# EAGLE design match2 (EAGLE 7.2.0)
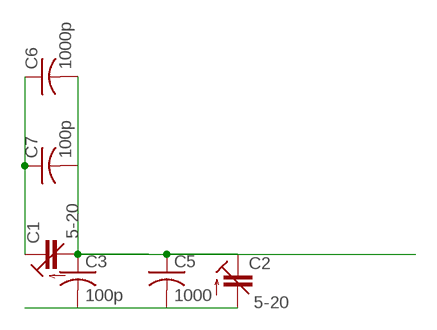
[diagram p0: schematic, sheet 1]

## Parts
C1  5-20  C-TRIMM  [SGC3S]
C2  5-20  C-TRIMM  [SGC3S]
C3  100p  C-USC0603  [C0603]
C5  1000  C-USC0805  [C0805]
C6  1000p  C-USC0805  [C0805]
C7  100p  C-USC0603  [C0603]

## Nets
N$1: C1.P$1(A) C2.P$2(E) C3.1 C5.1 C6.2 C7.2
N$2: C2.P$1(A) C3.2 C5.2
N$7: C1.P$2(E) C6.1 C7.1

## Library data of the parts
C1 C2 = sprague:C-TRIMM: Trimm capacitor
C3 C5-C7 = rcl:C-US: CAPACITOR, American symbol

## Board
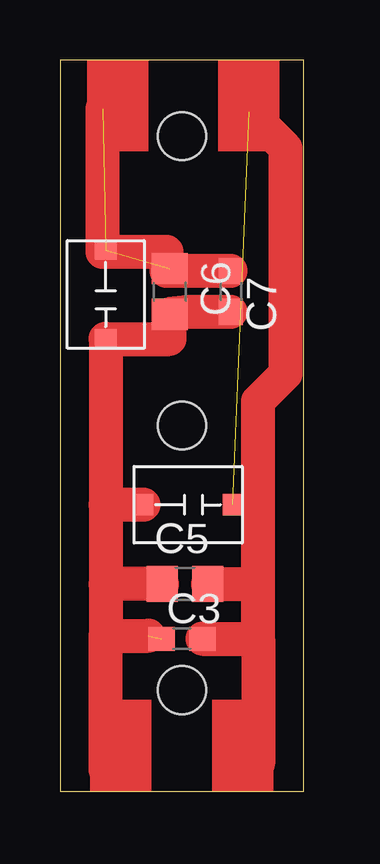
[diagram p1: board, top side]

Size 10.16 x 30.48 mm. Coordinates in mm from the lower left corner, seen from the top.
Outline: 0,0 10.16,0 10.16,30.48 0,30.48 0,0
Copper layers (1*16): Top 0.035mm / dielectric 1.5mm / Bottom 0.035mm
Design rules "default": minimum track width 10mil, minimum drill 24mil, track to track 8mil, track to pad 8mil, pad to pad 8mil, via to via 8mil, smd to smd 8mil, copper to edge 40mil, drill to drill 8mil, minimum pad ring 10mil, minimum via ring 8mil, stop-mask expansion 4mil, vias tented up to drill 0mil, thermal gap 10mil
Holes 2 mm at 5.08,15.24 5.08,4.22 5.08,27.3

### Footprints (pad centres in the part's own frame; a part is rotated, then mirrored left to right if it is on the bottom)
SGC3S = smd 0.9 x 0.8: P$1 0,1.85; P$2 0,-1.85
C0603 = smd 1.1 x 1: 1 -0.85,0; 2 0.85,0
C0805 = smd 1.3 x 1.5: 1 -0.95,0; 2 0.95,0

### Placement (x,y rotation side)
C1  1.91,20.7 180 top
C2  5.33,11.94 270 top
C3  5.08,6.35 0 top
C5  5.21,8.64 0 top
C6  4.57,20.83 270 top
C7  7.11,20.83 270 top

### Tracks (layer width: path | path; a pad name or v marks a point on that pad's centre or on a via)
N$1  (1 unrouted)
  Top 1.422: C7.2 5.33,19.98 C6.2 4.57,18.85 C1.P$1 1.91,11.94 | 1.91,11.94 1.91,8.64 | 1.91,8.64 1.91,6.48 | 1.91,0.89 1.91,6.48 | 1.91,6.48 3.68,6.48 | C5.1 1.91,8.64 | C2.P$2 1.91,11.94
N$2  (1 unrouted)
  Top 1.422: C3.2 8.26,6.35 | 8.26,6.35 8.26,1.14 | 8.26,6.35 8.26,8.64 | C5.2 8.26,8.64 | 8.26,8.64 8.26,16.26 9.4,17.4 9.4,26.8 7.87,28.32
N$7  (2 unrouted)
  Top 1.422: C7.1 4.45,21.68 4.45,22.48 1.78,22.48 1.78,28.45
(copper drawn outside any net)
  shapes: Top area x4